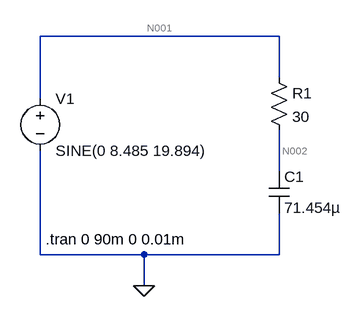
[diagram p0: schematic Lab3_1_3.asc]
Lab3_1_3.asc, the LTspice schematic file:
Version 4
SHEET 1 880 680
WIRE 448 16 80 16
WIRE 448 80 448 16
WIRE 80 112 80 16
WIRE 448 224 448 160
WIRE 80 352 80 192
WIRE 240 352 80 352
WIRE 448 352 448 288
WIRE 448 352 240 352
WIRE 240 400 240 352
FLAG 240 400 0
SYMBOL voltage 80 96 R0
WINDOW 123 0 0 Left 0
WINDOW 39 0 0 Left 0
SYMATTR InstName V1
SYMATTR Value SINE(0 8.485 19.894)
SYMBOL res 432 64 R0
SYMATTR InstName R1
SYMATTR Value 30
SYMBOL cap 432 224 R0
SYMATTR InstName C1
SYMATTR Value 71.454µ
TEXT 88 328 Left 2 !.tran 0 90m 0 0.01m

The netlist it stands for:
* Lab3_1_3.asc
V1 N001 0 SINE(0 8.485 19.894)
R1 N001 N002 30
C1 N002 0 71.454µ
.tran 0 90m 0 0.01m
.backanno
.end

* Results of the author's LTspice run, read from the files saved beside the schematic
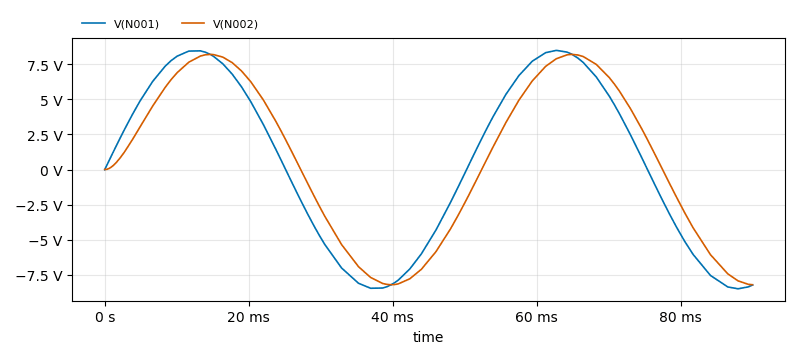
[diagram p1: Transient Analysis of Lab3_1_3.asc, plotted from the saved traces]
* Transient Analysis, 1 run:
*   V(N001): min -8.485 V, max 8.484 V, average 566.1 mV, rms 6.058 V, last -8.212 V
*   V(N002): min -8.196 V, max 8.198 V, average 761.2 mV, rms 5.731 V, last -8.196 V